# EAGLE design BITSv4 (EAGLE 9.2.2)
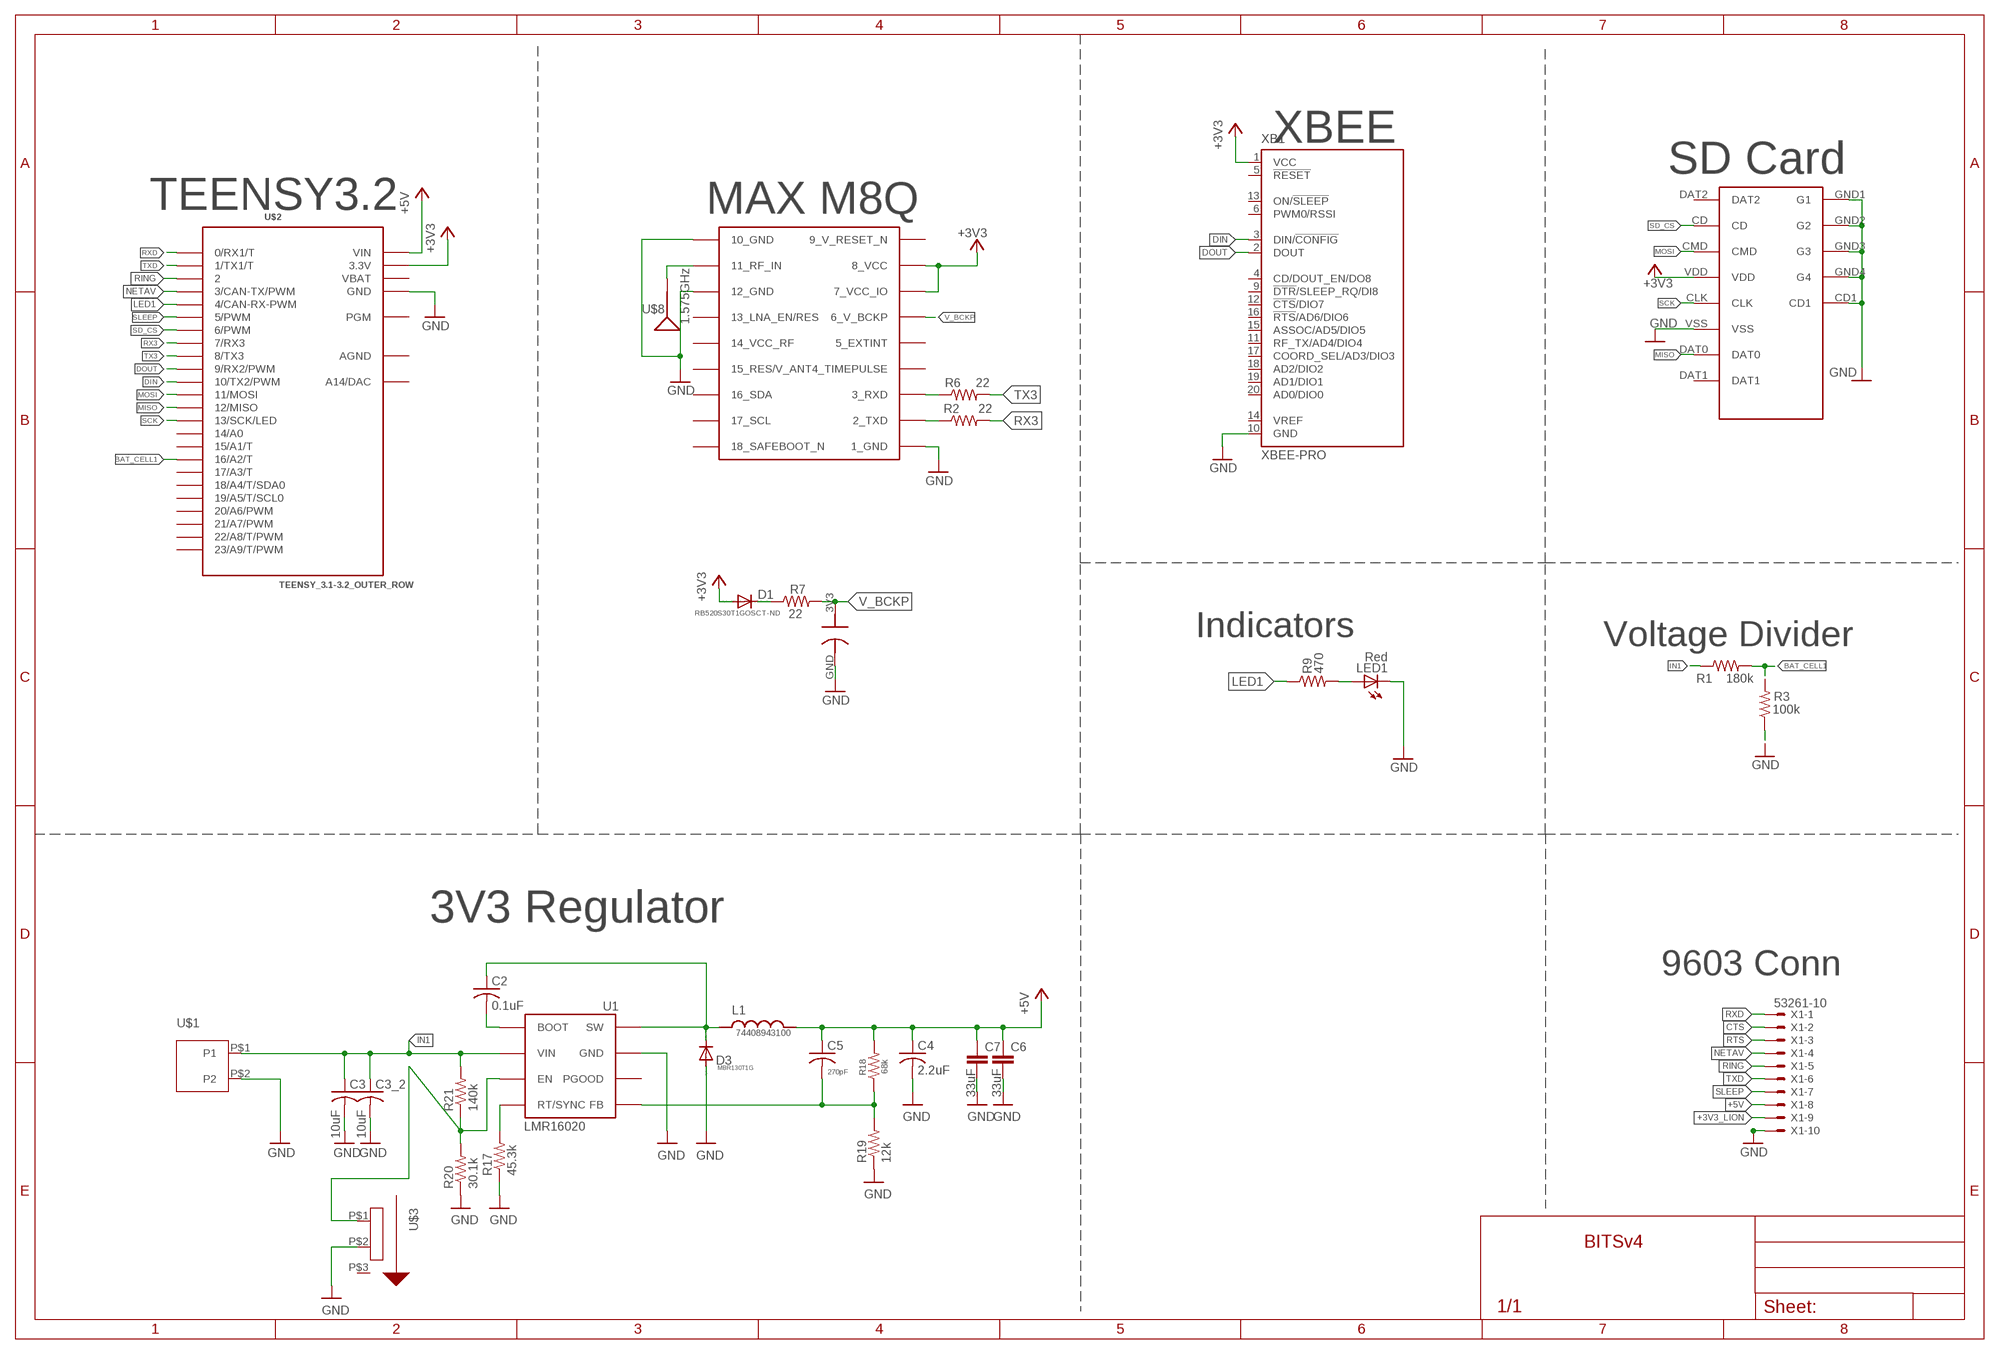
[diagram p0: schematic, sheet 1]

## Parts
C1  0.2F  DCK-3R3E204T614-E  [ELNASUPERCAP]
C2  0.1uF  C-USC0603  [C0603]
C3  10uF  C-USC0805  [C0805]
C3_2  10uF  C-USC0805  [C0805]
C4  2.2uF  C-USC0603  [C0603]
C5  270pF  C-USC0402  [C0402]
C6  33uF  C-EU050-024X044  [C050-024X044]
C7  33uF  C-EU050-024X044  [C050-024X044]
D1  RB520S30T1GOSCT-ND  DIODE-SOD523  [SOD523]
D3  MBR130T1G  CGRM4001-G  [SOD-123_MINI-SMA]
L1  74408943100  [74408943100]
LED1  Red  LEDCHIP-LED0603  [CHIP-LED0603]
R1  180k  R-US_R0603  [R0603]
R2  22  R-US_R0603  [R0603]
R3  100k  R-US_R0603  [R0603]
R6  22  R-US_R0603  [R0603]
R7  22  R-US_R0603  [R0603]
R9  470  R-US_R0603  [R0603]
R17  45.3k  R-US_R0603  [R0603]
R18  68k  R-US_R0603  [R0603]
R19  12k  R-US_R0603  [R0603]
R20  30.1k  R-US_R0603  [R0603]
R21  140k  R-US_R0603  [R0603]
U1  LMR16020  [SO8]
U$1  559350210  [559350210]
U$2  TEENSY_3.1-3.2_OUTER_ROW  [TEENSY_3.0-3.2&LC_OUTER_ROW]
U$3  CL-SB-12B-01  [CL-SB-12B-01]
U$4  MICRO_SD  [MICRO_SD_HINGED]
U$7  MAX-M8  [MAX-M8]
U$8  1.575GHz  SPARKFUN-GPS_ANTENNAGPS-2X7MM  [SPARKFUN-GPS_ANT-GPS-2X7MM]
X1  53261-10  [53261-10]
XB1  XBEE-PRO  [XBEE-PRO]

## Nets
+3V3: D1.A U$2.3.3V U$2.3.3V1(3.3V) U$4.VDD U$7.7_VCC_IO U$7.8_VCC XB1.1(VCC)
+3V3_LION: X1.9
+5V: C4.1 C5.1 C6.1 C7.1 L1.P$2 R18.2 U$2.VIN X1.8
BAT_CELL1: R1.2 R3.2 U$2.16/A2(16/A2/T)
CTS: X1.2
DIN: U$2.10(10/TX2/PWM) XB1.3(DIN/!CONFIG)
DOUT: U$2.9(9/RX2/PWM) XB1.2(DOUT)
FB: C5.2 R18.1 R19.2 U1.P$5(FB)
GND: C1.GND C3.2 C3_2.2 C4.2 C6.2 C7.2 D3.A LED1.C R3.1 R17.1 R19.1 R20.1 U1.P$7(GND) U1.PAD(GND) U$1.P$2(P2) U$2.GND U$2.GND1(GND) U$3.P$2(P2) U$4.CD1 U$4.GND1(G1) U$4.GND2(G2) U$4.GND3(G3) U$4.GND4(G4) U$4.VSS U$7.1_GND U$7.10_GND U$7.12_GND X1.10 XB1.10(GND)
IN1: C3.1 C3_2.1 R1.1 R21.2 U1.P$2(VIN) U$1.P$1(P1)
LED1: R9.1 U$2.4(4/CAN-RX-PWM)
MISO: U$2.12(12/MISO) U$4.DAT0
MOSI: U$2.11(11/MOSI) U$4.CMD
N$1: U$7.11_RF_IN U$8.1(SIGNAL)
N$2: D1.C R7.1
N$3: R6.1 U$7.3_RXD
N$4: R2.1 U$7.2_TXD
N$6: LED1.A R9.2
N$7: R20.2 R21.1 U1.P$3(EN) U$3.P$1(P1)
N$29: R17.2 U1.P$4(RT/SYNC)
N$31: C2.2 U1.P$1(BOOT)
NETAV: U$2.3(3/CAN-TX/PWM) X1.4
RING: U$2.2 X1.5
RTS: X1.3
RX3: R2.2 U$2.7(7/RX3)
RXD: U$2.0(0/RX1/T) X1.1
SCK: U$2.13(13/SCK/LED) U$4.CLK
SD_CS: U$2.6(6/PWM) U$4.CD
SLEEP: U$2.5(5/PWM) X1.7
SW: C2.1 D3.C L1.P$1 U1.P$8(SW)
TX3: R6.2 U$2.8(8/TX3)
TXD: U$2.1(1/TX1/T) X1.6
V_BCKP: C1.3V3 R7.2 U$7.6_V_BCKP
Unconnected: U1.P$6(PGOOD) U$2.14/A0 U$2.15/A1(15/A1/T) U$2.17/A3(17/A3/T) U$2.18/A4(18/A4/T/SDA0) U$2.19/A5(19/A5/T/SCL0) U$2.20/A6(20/A6/PWM) U$2.21/A7(21/A7/PWM) U$2.22/A8(22/A8/T/PWM) U$2.23/A9(23/A9/T/PWM) U$2.PGM U$2.RESET/DAC(A14/DAC) U$3.P$3(P3) U$4.DAT1 U$4.DAT2 U$7.4_TIMEPULSE U$7.5_EXTINT U$7.13_LNA_EN(13_LNA_EN/RES) U$7.14_VCC_RF U$7.15_V_ANT/RESERVED(15_RES/V_ANT) U$7.16_SDA U$7.17_SCL U$7.18_SAFEBOOT_N XB1.4(CD/DOUT_EN/DO8) XB1.5(!RESET) XB1.6(PWM0/RSSI) XB1.9(!DTR!/SLEEP_RQ/DI8) XB1.11(RF_TX/AD4/DIO4) XB1.12(!CTS!/DIO7) XB1.13(ON/!SLEEP) XB1.14(VREF) XB1.15(ASSOC/AD5/DIO5) XB1.16(!RTS!/AD6/DIO6) XB1.17(COORD_SEL/AD3/DIO3) XB1.18(AD2/DIO2) XB1.19(AD1/DIO1) XB1.20(AD0/DIO0)

## Notes on the sheet
- XBEE
- SD Card
- TEENSY3.2 | MAX M8Q
- Indicators | Voltage Divider
- 3V3 Regulator
- 9603 Conn

## Power pins joined to a net without a drawn wire
9_V_RESET_N: U$7.9_RESET_N(9_V_RESET_N)
AGND: U$2.AGND
VBAT: U$2.VBAT

## Library data of the parts
C1 = jmolterLib:DCK-3R3E204T614-E: ELNA Supercapacitor 3.3V max DCK-3R3E204T614-E 0.2F DCK-3R3E404T614-E 0.4F
C2 = resistor:C-US: CAPACITOR, American symbol
C3 C3_2 C4 C5 = rcl:C-US: CAPACITOR, American symbol; SPICEPREFIX: C
C6 C7 = rcl:C-EU: CAPACITOR, European symbol; SPICEPREFIX: C
D1 = diode:DIODE-: DIODE
D3 = diode:CGRM400*-G: Molded plasitc,JEDEC SOD-123/Mini SMA Source: Comchip CGRM4001-G.pdf
L1 = jmolterLib:74408943100
LED1 = led:LED: LED OSRAM: - CHIPLED LG R971, LG N971, LY N971, LG Q971, LY Q971, LO R971, LY R971 LH N974, LH R974 LS Q976, LO Q976, LY Q976 LO Q996 - Hyper CHIPLED LW Q18S LB Q993, LB Q99A, LB R99A - SideLED LS A670, LO A670, LY A670, LG A670, LP A670 LB A673, LV A673, LT A673, LW A673 LH A674 LY A675 LS A676, LA A676, LO A676, LY A676, LW A676 LS A679, LY A679, LG A679 - Hyper Micro SIDELED® LS Y876, LA Y876, LO Y876, LY Y876 LT Y87S - SmartLED LW L88C, LW L88S LB L89C, LB L89S, LG L890 LS L89K, LO L89K, LY L89K LS L896, LA L896, LO L896, LY L896 - TOPLED LS T670, LO T670, LY T670, LG T670, LP T670 LSG T670, LSP T670, LSY T670, LOP T670, LYG T670 LG T671, LOG T671, LSG T671 LB T673, LV T673, LT T673, LW T673 LH T674 LS T676, LA T676, LO T676, LY T676, LB T676, LH T676, LSB T676, LW T676 LB T67C, LV T67C, LT T67C, LS T67K, LO T67K, LY T67K, LW E67C LS E67B, LA E67B, LO E67B, LY E67B, LB E67C, LV E67C, LT E67C LW T67C LS T679, LY T679, LG T679 LS T770, LO T770, LY T770, LG T770, LP T770 LB T773, LV T773, LT T773, LW T773 LH T774 LS E675, LA E675, LY E675, LS T675 LS T776, LA T776, LO T776, LY T776, LB T776 LHGB T686 LT T68C, LB T68C - Hyper Mini TOPLED® LB M676 - Mini TOPLED Santana® LG M470 LS M47K, LO M47K, LY M47K Source: http://www.osram.convergy.de LUXEON: - LUMILED® LXK2-PW12-R00, LXK2-PW12-S00, LXK2-PW14-U00, LXK2-PW14-V00 LXK2-PM12-R00, LXK2-PM12-S00, LXK2-PM14-U00 LXK2-PE12-Q00, LXK2-PE12-R00, LXK2-PE12-S00, LXK2-PE14-T00, LXK2-PE14-U00 LXK2-PB12-K00, LXK2-PB12-L00, LXK2-PB12-M00, LXK2-PB14-N00, LXK2-PB14-P00, LXK2-PB14-Q00 LXK2-PR12-L00, LXK2-PR12-M00, LXK2-PR14-Q00, LXK2-PR14-R00 LXK2-PD12-Q00, LXK2-PD12-R00, LXK2-PD12-S00 LXK2-PH12-R00, LXK2-PH12-S00 LXK2-PL12-P00, LXK2-PL12-Q00, LXK2-PL12-R00 Source: www.luxeon.com KINGBRIGHT: KA-3528ASYC Source: www.kingbright.com
R1 R3 R9 R17-R21 = resistor:R-US_: RESISTOR, American symbol
R2 R6 R7 = rcl:R-US_: RESISTOR, American symbol; SPICEPREFIX: R
U1 = HASP:LMR16020
U$1 = jmolterLib:559350210: Molex MicroClasp 2mm Pitch Wire-to-Board Header Right-Angle, 2 Circuits
U$2 = Teensy_3_and_LC_Series_Boards_v1.4:TEENSY_3.1-3.2_OUTER_ROW: Footprint for Teensy 3.1 or 3.2 board using all pin connections on the outer perimeter
U$3 = jmolterLib:CL-SB-12B-01: SPDT Slide Switch Manuf: Nidec Copal Electronics
U$4 = NR_connectors:MICRO_SD
U$7 = ubloxLib:MAX-M8: u-blox MAX GNSS module
U$8 = Tracksoar v2 :SPARKFUN-GPS_ANTENNA: Single-ended Antennae 1.575GHz antennae with just one terminal. These are all chip antennae. 1575MHz (GPS) Antennae ANT-GPS-2X7MM - 2.0 x 7.0 mm chip antenna. (SparkFun Product <https://www.sparkfun.com/products/9131>) ANT-GPS-2X8MM - 2.0 x 8.0 mm chip antenna. (SparkFun Product <https://www.sparkfun.com/products/8418>); PROD_ID: ANT-09087; SF_ID: GPS-09131
X1 = con-molex:53?-10: CONNECTOR wire to board 1.25 mm (.049 inch) pitch header; MF: MOLEX; OC_FARNELL: unknown; OC_NEWARK: unknown
XB1 = maxstream:XBEE: XBee (TM) /XBee-PRO(TM) OEM RF Modules Source: MaxStream, Inc. xbee_productmanual.pdf

## Board
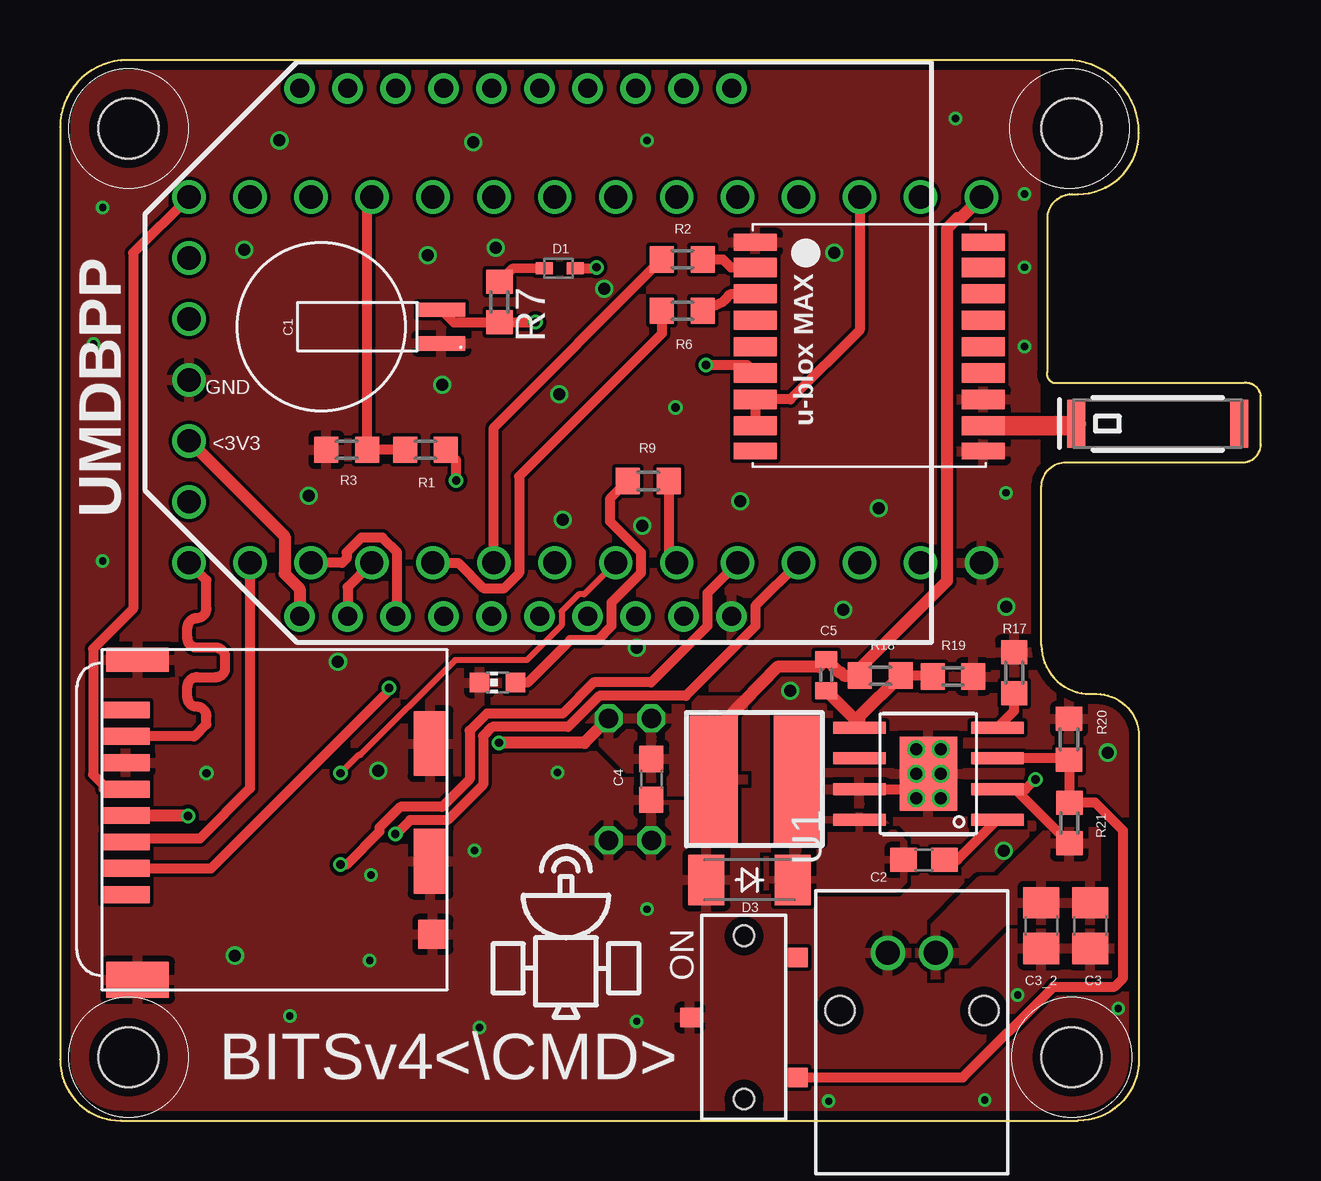
[diagram p1: board, top side]
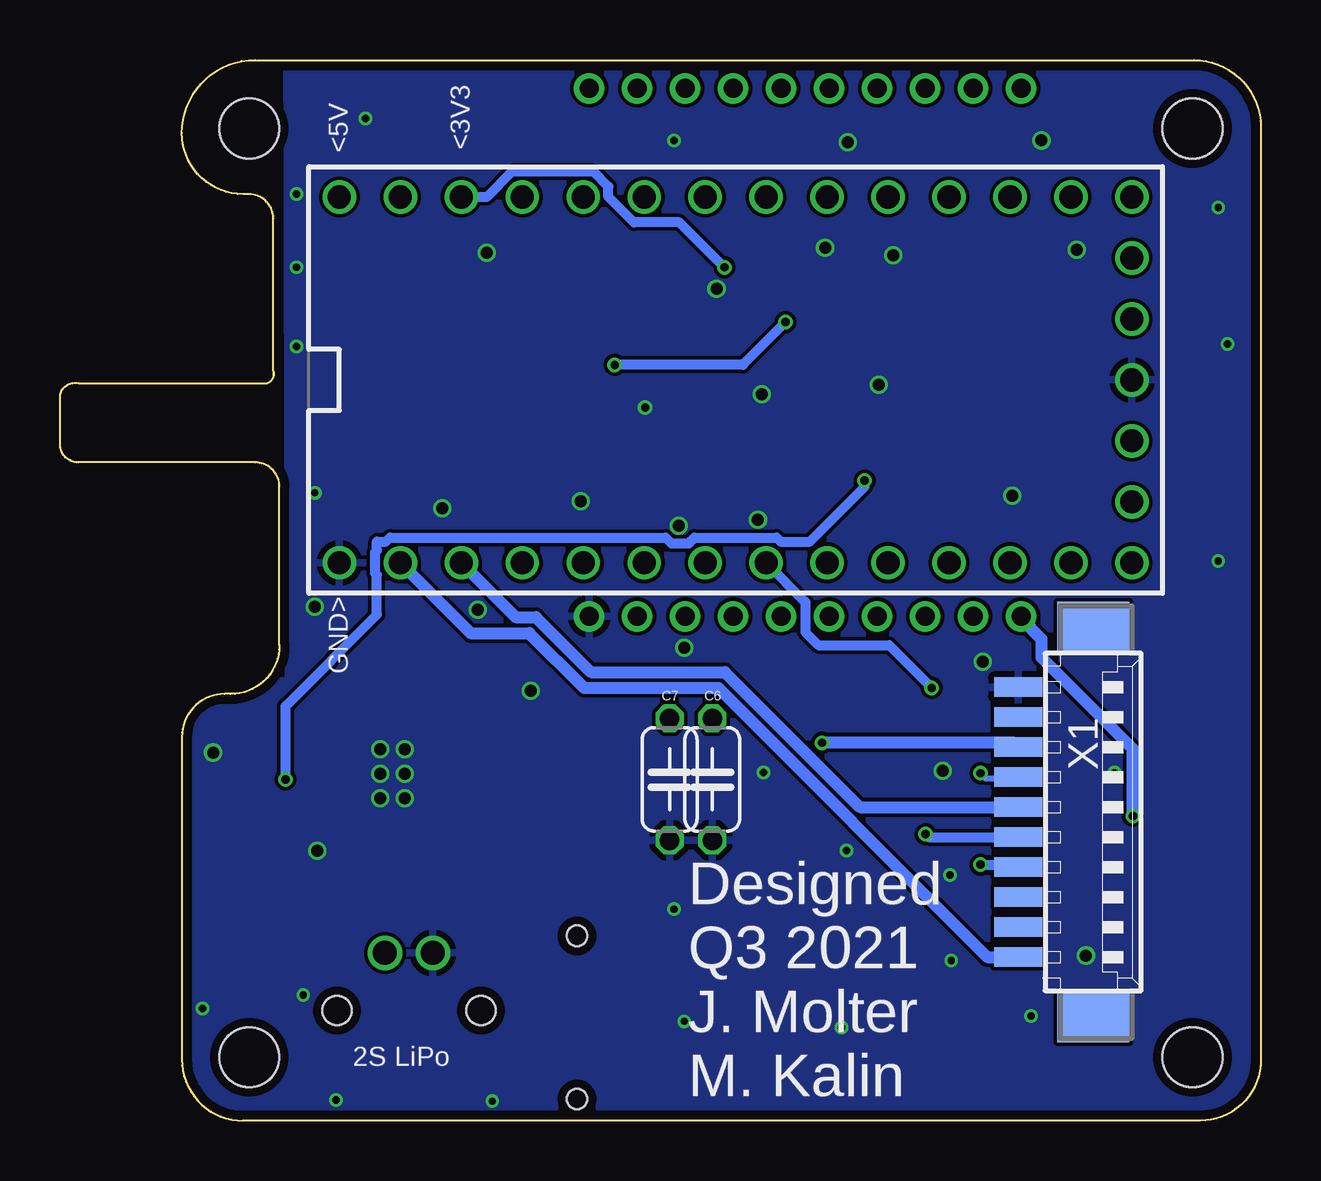
[diagram p2: board, bottom side, seen from below]

Size 50.04 x 44.2 mm. Coordinates in mm from the lower left corner, seen from the top.
Outline: 41.91,27.43 49.28,27.43 arc90 50.04,28.19 50.04,30.23 arc90 49.28,30.73 41.4,30.73 arc-90 41.15,31.24 41.15,37.59 arc-90 42.16,38.61 42.42,38.61 arc90 44.96,41.15 arc90 41.91,44.2 2.79,44.2 arc90 0,41.4 0,2.54 arc90 2.54,0 42.42,0 arc90 44.96,2.54 44.96,16 arc90 43.18,17.78 42.93,17.78 arc-90 40.89,19.81 40.89,26.42 arc-90 41.91,27.43
Copper layers (1*16): Top 0.035559375mm / dielectric 1.6mm / Bottom 0.035559375mm
Design rules "oshpark-2layer *": minimum track width 6mil, minimum drill 10mil, track to track 6mil, track to pad 6mil, pad to pad 6mil, via to via 6mil, smd to smd 6mil, copper to edge 15mil, drill to drill 6mil, minimum pad ring 5mil, minimum via ring 5mil, stop-mask expansion 2.5mil, vias tented up to drill 13mil, thermal gap 10mil
Holes 2.5 mm at 42.15,2.64 2.85,2.64 42.15,41.34 2.85,41.34

### Footprints (pad centres in the part's own frame; a part is rotated, then mirrored left to right if it is on the bottom)
ELNASUPERCAP = smd 0.6 x 2: 3V3 0.7,-1.5; GND -0.7,-1.5
C0603 = smd 1.1 x 1: 1 -0.85,0; 2 0.85,0
C0805 = smd 1.3 x 1.5: 1 -0.95,0; 2 0.95,0
C0402 = smd 0.7 x 0.9: 1 -0.65,0; 2 0.65,0
C050-024X044 = drill 0.813 octagon: 1 -2.54,0; 2 2.54,0
SOD523 = smd 0.7 x 0.5: A 0.7,0; C -0.6,0
SOD-123_MINI-SMA = smd 1.5 x 2.1: A 1.8,0; C -1.8,0
74408943100 = smd 5.3 x 2: P$1 0,0; P$2 0,3.5
CHIP-LED0603 = smd 0.8 x 0.8: A 0,-0.75; C 0,0.75
R0603 = smd 1 x 1.1: 1 -0.85,0; 2 0.85,0
SO8 = smd 0.5 x 2.2: P$1 -1.92,-2.875; P$2 -0.65,-2.875; P$3 0.65,-2.875; P$4 1.92,-2.875; P$5 1.92,2.875; P$6 0.65,2.875; P$7 -0.65,2.875; P$8 -1.92,2.875 | smd 3.1 x 2.4: PAD 0,0
559350210 = drill 1: P$1 3,-9.2; P$2 5,-9.2 | hole 1.2: 1,-6.8; 7,-6.8
TEENSY_3.0-3.2&LC_OUTER_ROW = drill 0.965: 0 -7.62,13.97; 1 -7.62,11.43; 2 -7.62,8.89; 3 -7.62,6.35; 3.3V 7.62,11.43; 3.3V1 -2.54,-16.51; 4 -7.62,3.81; 5 -7.62,1.27; 6 -7.62,-1.27; 7 -7.62,-3.81; 8 -7.62,-6.35; 9 -7.62,-8.89; 10 -7.62,-11.43; 11 -7.62,-13.97; 12 -7.62,-16.51; 13 7.62,-16.51; 14/A0 7.62,-13.97; 15/A1 7.62,-11.43; 16/A2 7.62,-8.89; 17/A3 7.62,-6.35; 18/A4 7.62,-3.81; 19/A5 7.62,-1.27; 20/A6 7.62,1.27; 21/A7 7.62,3.81; 22/A8 7.62,6.35; 23/A9 7.62,8.89; AGND 7.62,13.97; GND -7.62,16.51; GND1 0,-16.51; PGM 2.54,-16.51; RESET/DAC 5.08,-16.51; VBAT -5.08,-16.51; VIN 7.62,16.51
CL-SB-12B-01 = smd 0.8 x 0.8: P$1 1.75,-4; P$2 4.25,0.5; P$3 6.75,-4 | hole 0.85: 0.85,-1.75; 7.65,-1.75
MICRO_SD_HINGED = smd 0.7 x 2: CD -1.1,-13.4; CLK -4.4,-13.4; CMD -2.2,-13.4; DAT0 -6.6,-13.4; DAT1 -7.7,-13.4; DAT2 0,-13.4; VDD -3.3,-13.4; VSS -5.5,-13.4 | smd 2.7 x 1.4: CD1 -1.4,-0.7; GND3 -6.3,-0.7 | smd 1.5 x 2.6: GND1 3.55,-12.9 | smd 1.2 x 1.2: GND2 1.65,-0.6 | smd 1 x 2.6: GND4 -9.8,-12.9
MAX-M8 = smd 1.8 x 0.7: 1_GND 4.95,-4.4; 9_RESET_N 4.95,4.3; 10_GND -4.55,4.3; 18_SAFEBOOT_N -4.55,-4.4 | smd 1.8 x 0.8: 2_TXD 4.95,-3.35; 3_RXD 4.95,-2.25; 4_TIMEPULSE 4.95,-1.15; 5_EXTINT 4.95,-0.05; 6_V_BCKP 4.95,1.05; 7_VCC_IO 4.95,2.15; 8_VCC 4.95,3.25; 11_RF_IN -4.55,3.25; 12_GND -4.55,2.15; 13_LNA_EN -4.55,1.05; 14_VCC_RF -4.55,-0.05; 15_V_ANT/RESERVED -4.55,-1.15; 16_SDA -4.55,-2.25; 17_SCL -4.55,-3.35
SPARKFUN-GPS_ANT-GPS-2X7MM = smd 0.75 x 2: 1 -3.4,0; NC 3.4,0
53261-10 = smd 0.8 x 2: 1 5.625,-2.5; 2 4.375,-2.5; 3 3.125,-2.5; 4 1.875,-2.5; 5 0.625,-2.5; 6 -0.625,-2.5; 7 -1.875,-2.5; 8 -3.125,-2.5; 9 -4.375,-2.5; 10 -5.625,-2.5 | smd 2.1 x 3: S1 8.125,0.625; S2 -8.125,0.625
XBEE-PRO = drill 0.8 pad 1.27: 1 -11,9; 2 -11,7; 3 -11,5; 4 -11,3; 5 -11,1; 6 -11,-1; 7 -11,-3; 8 -11,-5; 9 -11,-7; 10 -11,-9; 11 11,-9; 12 11,-7; 13 11,-5; 14 11,-3; 15 11,-1; 16 11,1; 17 11,3; 18 11,5; 19 11,7; 20 11,9

### Placement (x,y rotation side)
C1  14.39,33.09 90 top
C2  36,10.86 0 top
C3  42.93,8.13 270 top
C3_2  40.89,8.13 270 top
C4  24.64,14.22 270 top
C5  31.93,18.57 270 top
C6  22.86,14.22 270 bottom
C7  24.64,14.22 270 bottom
D1  20.77,35.52 0 top
D3  28.73,10.03 180 top
L1  30.73,14.22 90 top
LED1  18.23,18.26 90 top
R1  15.23,27.96 180 top
R2  25.93,35.89 180 top
R3  11.95,27.96 0 top
R6  25.93,33.75 180 top
R7  18.31,34.11 270 top
R9  24.51,26.65 180 top
R17  39.76,18.66 270 top
R18  34.18,18.54 180 top
R19  37.21,18.51 180 top
R20  42.04,15.89 270 top
R21  42.06,12.4 270 top
U1  36.19,14.46 90 top
U$1  39.5,-2.21 180 top
U$2  21.89,30.87 90 bottom
U$3  26.75,0.05 90 top
U$4  16.14,9.41 270 top
U$7  33.92,32.2 180 top
U$8  45.74,29.04 0 top
X1  7.62,12.45 270 bottom
XB1  18.99,32.02 90 top

### Tracks (layer width: path | path; a pad name or v marks a point on that pad's centre or on a via)
+3V3  (via drill 0.35)
  Top 0.406: 2.75,12.7 U$4.VDD | U$2.3.3V 33.32,32.94 30.44,30.05 U$7.7_VCC_IO U$7.8_VCC | D1.A 22.31,35.52 v22.35,35.56
  Top 0.508: XB1.1 9.99,22.16 9.35,22.79 9.35,24.35 U$2.3.3V1 | v5.33,12.7 2.75,12.7
  Bottom 0.406: v22.35,35.56 24.23,37.44 26.13,37.44 27.18,38.49 27.18,38.92 27.8,39.54 31.21,39.54 32.26,38.49 U$2.3.3V
  Bottom 0.508: XB1.1 9.99,20.91 9.14,20.07 9.14,19.3 5.33,15.49 v5.33,12.7
+5V  (via drill 0.35)
  Top 0.508: L1.P$2 27.74,14.73 27.74,16.71 29.89,18.9 31.61,18.9 C5.1 32.47,18.67 32.55,18.67 32.67,18.54 R18.2 33.33,18.86 36.96,22.48 36.96,37.17 37.4,37.62 37.52,37.62 U$2.VIN | C6.1 21.84,15.75 v18.29,15.75
  Bottom 0.508: X1.8 10.31,15.76 18.27,15.76 v18.29,15.75
  pour Top: 28.45,13.72 24.64,13.72 22.1,16.26 22.1,17.02 22.61,17.53 28.45,17.53
BAT_CELL1
  Top 0.406: R1.2 12.81,27.95 12.8,27.94 R3.2 12.8,38.29 U$2.16/A2
DIN
  Top 0.406: U$2.10 11.76,23.25 11.94,23.43 11.94,23.68 12.56,24.3 13.43,24.3 14.05,23.68 14.05,21.08 XB1.3
DOUT
  Top 0.406: U$2.9 11.99,22.24 XB1.2
FB
  Top 0.406: R19.2 36.32,18.54 R18.1 | U1.P$5 33.31,16.82
  Top 0.508: C5.2 33.31,16.53 33.31,16.82 R18.1
GND  (via drill 0.3, 0.35, 0.5)
  Top 0.254: 35.31,13.81 v35.68,13.44
  Top 0.406: U1.P$7 35.31,13.81
  other vias: 13.26,14.58 11.58,19.13 15.32,36.07 1.78,23.32 7.67,36.3 17.22,40.77 18.16,36.37 22.68,34.67 15.93,30.66 20.95,25.04 28.35,25.81 20.8,30.28 39.42,26.16 32.26,36.17 34.11,25.53 32.64,21.29 38.53,0.86 32.03,0.81 9.58,4.37 43.66,15.34 39.42,21.41 24.46,40.84 35.68,14.46 35.68,15.47 36.7,13.44 36.7,14.46 36.7,15.47 20.73,14.5 6.1,14.48 25.65,29.72 37.31,41.76 12.95,10.24 10.36,26.04 30.43,17.91 39.32,11.25 39.9,5.23 24.46,8.81 24.03,4.14 1.78,38.05 9.14,40.84 24.26,24.79 1.4,32.36 12.9,6.68 17.48,3.89 40.18,32.26 40.18,38.61 40.18,35.56 17.27,11.25 7.29,6.88 44.09,4.67 24.03,19.71
  pour Bottom (rank 6): -0.55,-2.51 -0.55,47.49 40.59,47.22 40.53,18.34 43.13,18.34 45.9,15.57 45.9,-2.51
  pour Top (rank 6): -1.02,-1.78 -1.02,41.91 1.27,44.2 40.64,44.2 40.64,20.32 43.18,17.78 43.69,17.78 45.72,15.75 45.72,-2.54 -0.25,-2.54
IN1  (via drill 0.35)
  Top 0.406: U1.P$2 39.8,13.81 | 39.8,13.81 R21.2 | 39.8,13.81 40.22,13.81 v40.64,14.22 | v16.51,26.67 16.51,27.52 R1.1
  Bottom 0.406: v40.64,14.22 40.64,17.27 36.83,21.08 36.83,22.73 36.91,22.81 36.91,23.68 36.83,23.76 36.83,24.13 36.46,24.13 36.29,24.3 24.8,24.3 24.56,24.06 23.83,24.06 23.59,24.3 20.18,24.3 20.01,24.13 18.8,24.13 16.51,26.42 v16.51,26.67
  pour Top: 35.81,7.45 35.81,6.6 36.32,6.1 37.08,6.1 39.37,8.38 43.18,8.38 43.18,12.02 41.15,12.02 39.12,9.99 38.35,9.99
LED1
  Top 0.406: R9.1 25.36,23.59 U$2.4
MISO
  Top 0.406: U$2.12 6.1,22.53 6.1,21.34 arc-90 5.7,20.94 arc90 5.31,20.55 5.31,20.11 arc90 5.7,19.71 6.49,19.71 arc-90 6.88,19.32 6.88,18.87 arc-90 6.49,18.48 5.7,18.48 arc90 5.31,18.09 5.31,17.64 arc90 5.7,17.25 arc-90 6.1,16.86 6.1,16.51 5.59,16 5.58,16.01 U$4.DAT0
MOSI
  Top 0.406: U$4.CMD 2.88,11.75 5.83,11.75 7.92,13.84 U$2.11
N$1
  Top 0.813: U$7.11_RF_IN 42.25,28.95 U$8.1
N$2
  Top 0.406: D1.C 18.84,35.5 R7.1
N$3
  Top 0.406: R6.1 27.65,34.15 27.95,34.45 U$7.3_RXD
N$4
  Top 0.406: R2.1 27.62,35.89 27.95,35.55 U$7.2_TXD
N$6
  Top 0.406: LED1.A 19.49,18.26 21.26,20.03 22.4,20.03 22.98,20.61 22.98,21.58 24.21,22.81 24.21,23.68 22.91,24.97 22.91,25.91 R9.2
N$7
  Top 0.406: U1.P$3 41.98,15.11 R20.2 42.04,13.27 R21.1 43.13,13.25 44.3,12.09 44.3,5.94 43.94,5.59 41.4,5.59 37.61,1.8 U$3.P$1
N$29
  Top 0.406: U1.P$4 39.76,17.07 R17.2
N$31
  Top 0.406: C2.2 37.39,10.86 U1.P$1
NETAV  (via drill 0.35)
  Top 0.406: U$2.3 26.98,21.99 26.98,20.61 24.63,18.26 22.24,18.26 20.94,16.96 17.78,16.96 17.07,16.25 17.07,14.23 15.92,13.08 14.18,13.08 13.31,12.21 13.31,12.04 11.94,10.67 v11.68,10.67
  Bottom 0.406: v11.68,10.67 10.22,10.67 X1.4
RING  (via drill 0.35)
  Top 0.406: U$2.2 28.98,21.45 28.98,20.61 26.08,17.7 22.47,17.7 21.17,16.41 18.02,16.41 17.63,16.02 17.63,14 16.15,12.52 14.59,12.52 14.01,11.94 v13.97,11.94
  Bottom 0.406: v13.97,11.94 13.85,11.82 X1.5
RX3
  Top 0.406: U$2.7 18.08,28.88 R2.2
RXD
  Bottom 0.508: U$2.0 32.93,20.32 30.48,20.32 28.19,18.03 22.61,18.03 11.39,6.82 X1.1
SCK
  Top 0.305: 1.81,13.81 U$4.CLK
  Top 0.406: U$2.13 3.05,36.16 3.05,21.33 1.38,19.66 1.38,14.42 1.81,13.99 1.81,13.81
SD_CS  (via drill 0.35)
  Top 0.406: v13.72,18.03 13.77,17.98 6.29,10.51 U$4.CD
  Bottom 0.406: U$2.6 18.98,21.61 18.98,20.35 18.44,19.81 15.49,19.81 v13.72,18.03
SLEEP  (via drill 0.35)
  Top 0.254: U$2.5 21.84,21.93 21.61,21.93 20.9,21.22 20.9,20.64 19.45,19.19 16.47,19.19 12.52,15.24 12.45,15.24 v11.68,14.48
  Bottom 0.254: X1.7 10.18,14.26 11.46,14.26 v11.68,14.48
SW
  Top 0.406: C2.1 34.98,10.86
  pour Top: 29.46,12.7 34.04,12.7 35.56,11.18 35.56,10.41 34.8,9.65 29.46,9.65
TX3
  Top 0.406: U$2.8 16.59,23.25 17.64,22.2 18.51,22.2 19.13,22.81 19.13,26.84 25.08,32.8 R6.2
TXD
  Bottom 0.508: U$2.1 31.05,20.98 30.21,20.98 27.92,18.69 22.33,18.69 16.71,13.07 X1.6
V_BCKP  (via drill 0.35)
  Top 0.406: v19.81,33.27 18.32,33.27 arc90 R7.2 16.41,33.26 C1.3V3 | v26.92,31.5 28.63,31.5 U$7.6_V_BCKP
  Bottom 0.406: v19.81,33.27 21.59,31.5 v26.92,31.5

### Text on the board
tPlace: GND | <3V3 | UMDBPP | ON | BITSv4<\\CMD>
bPlace: <3V3 | <5V | GND> | 2S LiPo | Designed / Q3 2021 / J. Molter / M. Kalin